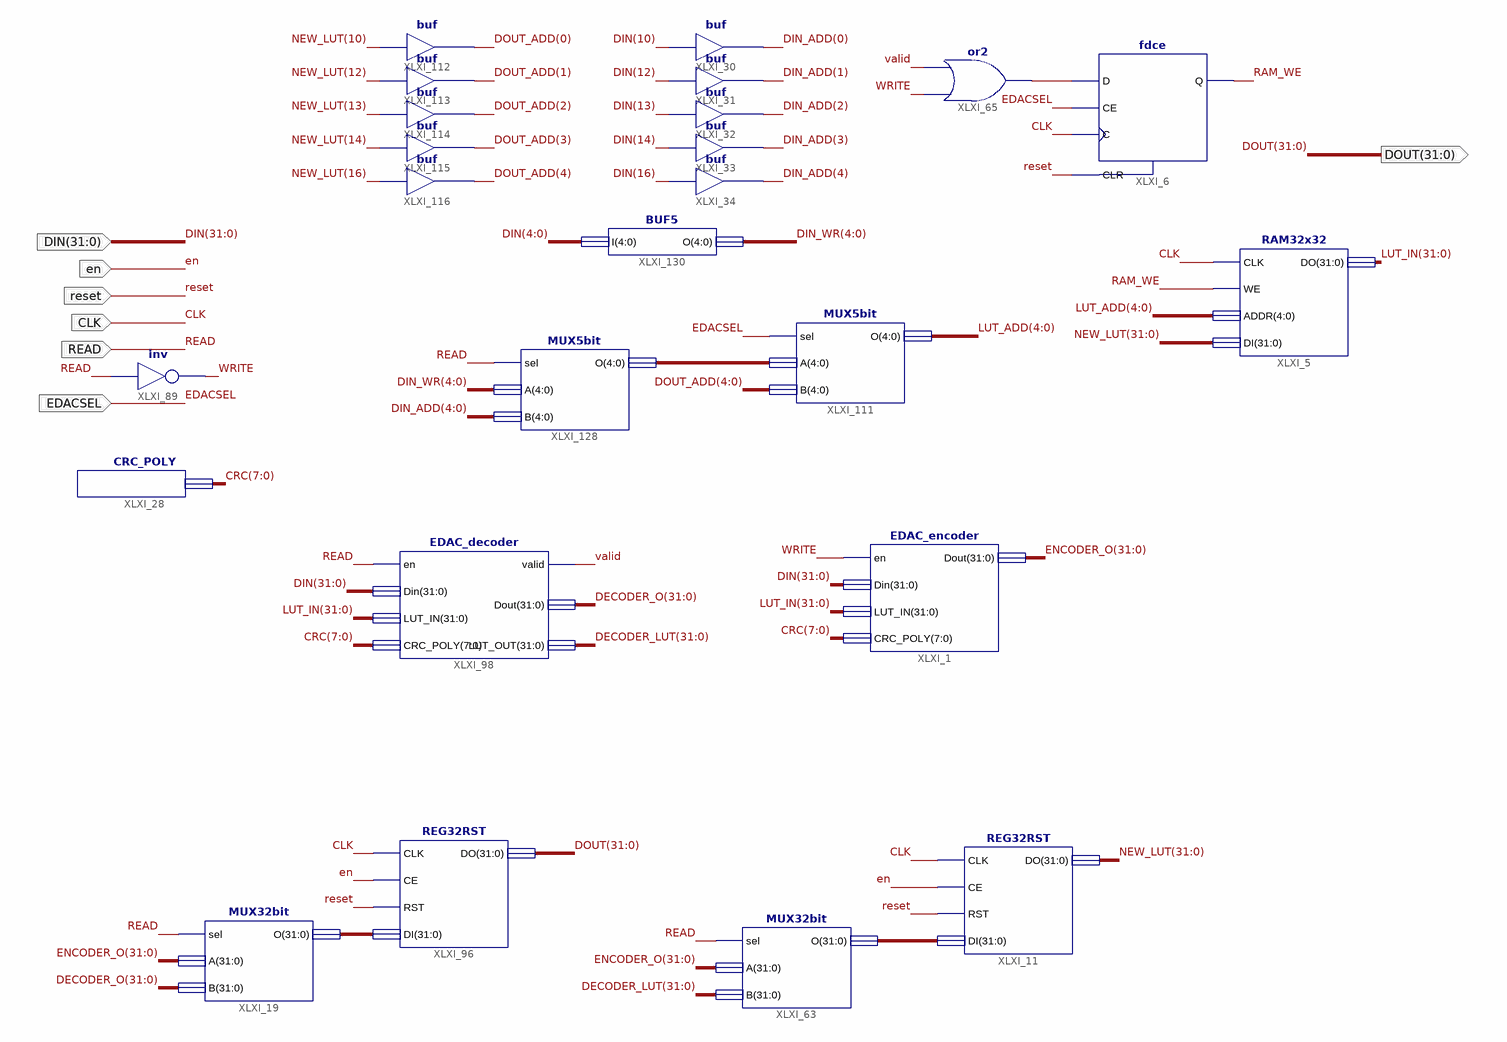
[diagram p0: schematic sheet 1]
// Xilinx ISE schematic EDAC_SCHEM.sch (spartan6) as structural Verilog: 24 symbols, 7 ports
module EDAC_SCHEM (
  input  [31:0] DIN,
  input  en,
  input  CLK,
  input  reset,
  input  EDACSEL,
  input  READ,
  output [31:0] DOUT
);

  wire RAM_WE, valid, WRITE, XLXN_236;
  wire [4:0] DIN_ADD, DIN_WR, DOUT_ADD, LUT_ADD, XLXN_393;
  wire [7:0] CRC;
  wire [31:0] DECODER_LUT, DECODER_O, ENCODER_O, LUT_IN, NEW_LUT, XLXN_230, XLXN_295;

  EDAC_encoder XLXI_1 (.en(WRITE), .Din(DIN), .LUT_IN(LUT_IN), .CRC_POLY(CRC), .Dout(ENCODER_O));
  buf XLXI_30 (DIN_ADD[0], DIN[10]);
  buf XLXI_31 (DIN_ADD[1], DIN[12]);
  buf XLXI_32 (DIN_ADD[2], DIN[13]);
  buf XLXI_33 (DIN_ADD[3], DIN[14]);
  buf XLXI_34 (DIN_ADD[4], DIN[16]);
  CRC_POLY XLXI_28 (.O(CRC));
  REG32RST XLXI_96 (.CLK(CLK), .CE(en), .RST(reset), .DI(XLXN_295), .DO(DOUT));
  EDAC_decoder XLXI_98 (
    .en(READ), .Din(DIN), .LUT_IN(LUT_IN), .CRC_POLY(CRC), .valid(valid), .Dout(DECODER_O),
    .LUT_OUT(DECODER_LUT));
  RAM32x32 XLXI_5 (.CLK(CLK), .WE(RAM_WE), .ADDR(LUT_ADD), .DI(NEW_LUT), .DO(LUT_IN));
  buf XLXI_112 (DOUT_ADD[0], NEW_LUT[10]);
  buf XLXI_113 (DOUT_ADD[1], NEW_LUT[12]);
  buf XLXI_114 (DOUT_ADD[2], NEW_LUT[13]);
  buf XLXI_115 (DOUT_ADD[3], NEW_LUT[14]);
  buf XLXI_116 (DOUT_ADD[4], NEW_LUT[16]);
  MUX32bit XLXI_19 (.sel(READ), .A(ENCODER_O), .B(DECODER_O), .O(XLXN_295));
  REG32RST XLXI_11 (.CLK(CLK), .CE(en), .RST(reset), .DI(XLXN_230), .DO(NEW_LUT));
  MUX32bit XLXI_63 (.sel(READ), .A(ENCODER_O), .B(DECODER_LUT), .O(XLXN_230));
  or XLXI_65 (XLXN_236, WRITE, valid);
  fdce XLXI_6 (.C(CLK), .CE(EDACSEL), .CLR(reset), .D(XLXN_236), .Q(RAM_WE));
  MUX5bit XLXI_128 (.sel(READ), .A(DIN_WR), .B(DIN_ADD), .O(XLXN_393));
  MUX5bit XLXI_111 (.sel(EDACSEL), .A(XLXN_393), .B(DOUT_ADD), .O(LUT_ADD));
  BUF5 XLXI_130 (.I(DIN[4:0]), .O(DIN_WR));
  not XLXI_89 (WRITE, READ);
endmodule
